# Altium project DC-DC_LED_driver_v5.3.PrjPcb
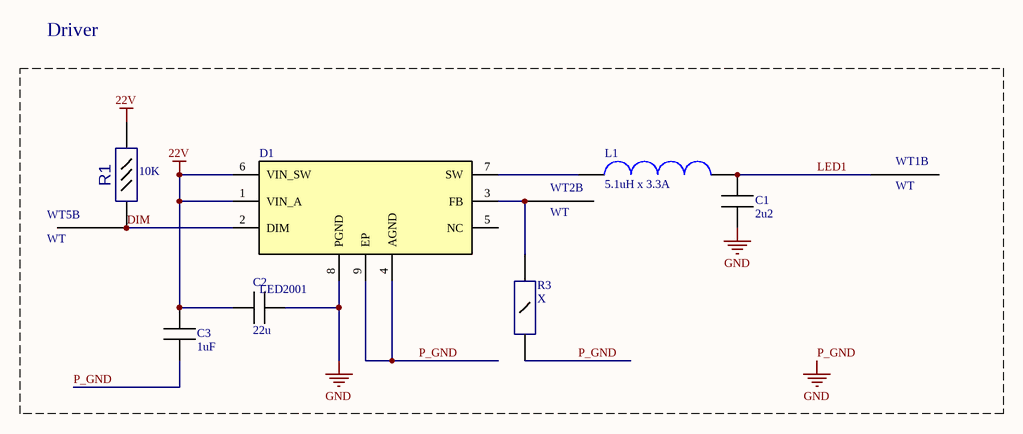
[diagram p0: Scheme.SchDoc]
1 sheet, 10 parts. Net scope: global (net labels, ports and power ports of the same name join across sheets).
Board file: PCB.PcbDoc

## Sheet Scheme.SchDoc
size A4

### Parts
C1  2u2  [Cap 0603]
C2  22u  [Cap 1206]
C3  value 1uF  [Cap 0603]  (hidden comment: 1u0)
D1  LED2001  [VQFPN-8 4x4]
L1  value 5.1uH x 3.3A  [ASPI-6045S-5R1N-T]  (hidden comment: 51)
R1  value 10K  [R0603 5%]  (hidden comment: 103)
R3  X  [Resistor 1206]
WT1  value WT  [WT]  (hidden comment: *)  (part B of 2)
WT2  value WT  [WT]  (hidden comment: *)  (part B of 2)
WT5  value WT  [WT]  (hidden comment: *)  (part B of 2)

### Nets
22V: C2.1 C3.2 D1.1(VIN_A) D1.6(VIN_SW) R1.2
P_GND: C1.1 C2.2 C3.1 D1.4(AGND) D1.8(PGND) D1.9(EP) R3.1  [also labelled GND]
DIM: D1.2(DIM) R1.1 WT5.1
LED1: C1.2 L1.2 WT1.1
NetD1_3: D1.3(FB) R3.2 WT2.1
NetD1_7: D1.7(SW) L1.1

Not connected (* = marked no-connect by the designer): D1 5(NC)

### Notes on the sheet
- Driver

### Library data of the parts
C1 = CMP-00038-2: C 2.2uF  x 25V; Component Name: Ceramic Capacitor, SMD, 0603, X7R, 2.2uF  x 25V 10%; ID: CCSM20225120; Найменування компонента: Конденсатор керамический, SMD, 0603, X7R, 2.2uF  x 25V 10%; Package: 0603; Value: 2u2; Marking: 2u2; Voltage: 25V
C2 = CMP-00564-1: C 22uF x 25V; Component Name: Ceramic Capacitor, SMD, 1206, X7R, 22uF x 25V; Найменування компонента: Конденсатор керамический, SMD, 1206, X7R, 22uF x 25V; Value: 22u; Voltage: 25V; Marking: 22u; Package: 1206
C3 = CMP-00074-2: C 1uF  x 25V; ID: CCSM20105120; Найменування компонента: Конденсатор керамический, SMD, 0603, X7R, 1uF  x 25V 10%; Component Name: Ceramic Capacitor, SMD, 0603, X7R, 1uF  x 25V 10%; Package: 0603; Marking: 1u0; Voltage: 25V
D1 = CMP-00546-6: Component Name: IC, Step-down DC-DC converter , LED2001, VFQFPN-8; Value: LED2001; ComponentLink1Description: Datasheet; Mounting type: SMD; ComponentLink1URL: http://www.st.com/content/ccc/resource/technical/document/datasheet/37/ed/f7/77/d7/ed/4e/84/DM00079085.pdf/files/DM00079085.pdf/jcr:content/translations/en.DM00079085.pdf; Marking: LED2001; Package: VFQFPN-8
L1 = CMP-00554-1: ASPI-6045S-5R1N-T, 5.1uH x 3.3A; Component Name: Power Inductor,  ASPI-6045S-5R1N-T, 5.1uH x 3.3A; Найменування компонента: Индуктивность,  ASPI-6045S-5R1N-T, 5.1uH x 3.3A; ComponentLink1Description: Datasheet; Mounting type: SMD; ComponentLink1URL: http://www.abracon.com/Magnetics/power/ASPI-6045S.pdf; Marking: 51; Package: 6x6mm
R1 = CMP-00052-2: R 10K; Component Name: Fixed resistor, SMD, 0603, 10K 5%; ID: RRSM20103300; Найменування компонента: Резистор, SMD, 0603, 10 KОм 5%; Package: 0603; Marking: 103
R3 = CMP-00516-2: R X; Component Name: Fixed resistor, SMD, 1206, X; Найменування компонента: Резистор, SMD, 1206, X; Value: X; Marking: X; Package: 1206
WT1 WT2 WT5 = CMP-00159-1: WT; Component Name: Connector, WT; ID: *; Marking: *; Package: WT; Найменування компонента: *; ComponentLink1Description: Datasheet; ComponentLink1URL: *; PartId: 2